# EAGLE schematic Motor (EAGLE 7.2.0)
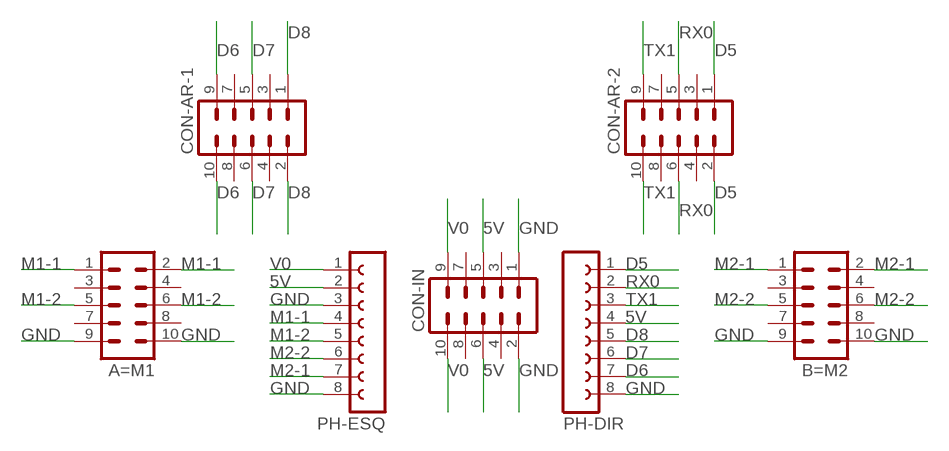
[diagram p0: schematic, sheet 1]

## Parts
A=M1  ML10L  [ML10L]
B=M2  ML10L  [ML10L]
CON-AR-1  MA05-2  [MA05-2]
CON-AR-2  MA05-2  [MA05-2]
CON-IN  MA05-2  [MA05-2]
PH-DIR  FE08W  [FE08W]
PH-ESQ  FE08W  [FE08W]

## Nets
5V: CON-IN.5 CON-IN.6 PH-DIR.4 PH-ESQ.2
D5: CON-AR-2.1 CON-AR-2.2 PH-DIR.1
D6: CON-AR-1.9 CON-AR-1.10 PH-DIR.7
D7: CON-AR-1.5 CON-AR-1.6 PH-DIR.6
D8: CON-AR-1.1 CON-AR-1.2 PH-DIR.5
GND: A=M1.9 A=M1.10 B=M2.9 B=M2.10 CON-IN.1 CON-IN.2 PH-DIR.8 PH-ESQ.3 PH-ESQ.8
M1-1: A=M1.1 A=M1.2 PH-ESQ.4
M1-2: A=M1.5 A=M1.6 PH-ESQ.5
M2-1: B=M2.1 B=M2.2 PH-ESQ.7
M2-2: B=M2.5 B=M2.6 PH-ESQ.6
RX0: CON-AR-2.5 CON-AR-2.6 PH-DIR.2
TX1: CON-AR-2.9 CON-AR-2.10 PH-DIR.3
V0: CON-IN.9 CON-IN.10 PH-ESQ.1
Unconnected: A=M1.3 A=M1.4 A=M1.7 A=M1.8 B=M2.3 B=M2.4 B=M2.7 B=M2.8 CON-AR-1.3 CON-AR-1.4 CON-AR-1.7 CON-AR-1.8 CON-AR-2.3 CON-AR-2.4 CON-AR-2.7 CON-AR-2.8 CON-IN.3 CON-IN.4 CON-IN.7 CON-IN.8

## Library data of the parts
A=M1 B=M2 = con-ml:ML10L: HARTING; OC_FARNELL: unknown; OC_NEWARK: unknown
CON-AR-1 CON-AR-2 CON-IN = con-lstb:MA05-2: PIN HEADER; OC_FARNELL: unknown; OC_NEWARK: unknown
PH-DIR PH-ESQ = con-lsta:FE08W: FEMALE HEADER; OC_FARNELL: unknown; OC_NEWARK: unknown